# EAGLE design rgb_v3 (EAGLE 6.5.0)
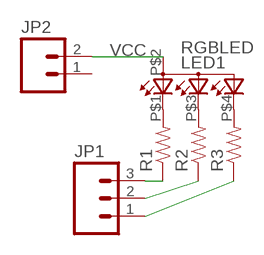
[diagram p0: schematic, sheet 1]

## Parts
JP1  M03NONPOLAR  [1X03NONPOLAR]
JP2  M02PTH  [1X02]
LED1  RGBLED  [CLVBA-FKA-CAEDH8BBB7A363]
R1  RESISTOR0402-RES  [0402-RES]
R2  RESISTOR0402-RES  [0402-RES]
R3  RESISTOR0402-RES  [0402-RES]

## Nets
N$1: LED1.P$1(CRED) R1.2
N$2: LED1.P$3(CBLUE) R2.2
N$3: LED1.P$4(CGREEN) R3.2
N$4: JP1.2 R2.1
N$5: JP1.1 R3.1
N$6: JP1.3 R1.1
VCC: JP2.2 LED1.P$2(A)
Unconnected: JP2.1

## Library data of the parts
JP1 = SparkFun-Connectors:M03: Header 3 Standard 3-pin 0.1" header. Use with straight break away headers (SKU : PRT-00116), right angle break away headers (PRT-00553), swiss pins (PRT-00743), machine pins (PRT-00117), and female headers (PRT-00115). Molex polarized connector foot print use with SKU : PRT-08232 with associated crimp pins and housings.
JP2 = SparkFun-Connectors:M02: Header 2 Standard 2-pin 0.1" header. Use with straight break away headers (SKU : PRT-00116), right angle break away headers (PRT-00553), swiss pins (PRT-00743), machine pins (PRT-00117), and female headers (PRT-00115). Molex polarized connector foot print use with SKU : PRT-08233 with associated crimp pins and housings.
LED1 = my library:RGBLED: Chip LED RGB Source: http://document.sharpsma.com/files/GM1WA55311A_SS.pdf
R1-R3 = SparkFun-Resistors:RESISTOR: Resistor Basic schematic elements and footprints for 0603, 1206, and PTH resistors.

## Board
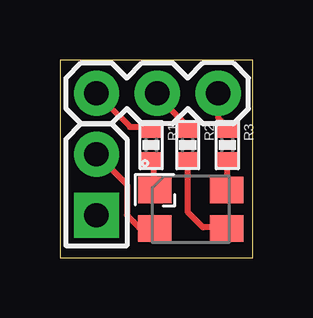
[diagram p1: board, top side]
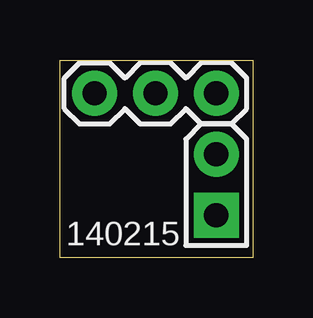
[diagram p2: board, bottom side, seen from below]

Size 8.05 x 8.24 mm. Coordinates in mm from the lower left corner, seen from the top.
Outline: 0,0 8.05,0 8.05,8.24 0,8.24 0,0
Copper layers (1*16): Top 0.0356mm / dielectric 1.5011mm / Bottom 0.0356mm
Design rules "LaenPCBOrder *": minimum track width 10mil, minimum drill 13mil, track to track 6mil, track to pad 6mil, pad to pad 6mil, via to via 6mil, smd to smd 6mil, copper to edge 15mil, drill to drill 6mil, minimum pad ring 7mil, minimum via ring 7mil, stop-mask expansion 3mil, vias tented up to drill 0mil, thermal gap 10mil

### Footprints (pad centres in the part's own frame; a part is rotated, then mirrored left to right if it is on the bottom)
1X03NONPOLAR = drill 1.016 pad 1.88: 1 0,0; 2 2.54,0; 3 5.08,0
1X02 = drill 1.016 pad 1.88 square: 1 0,0 | drill 1.016 pad 1.88: 2 2.54,0
CLVBA-FKA-CAEDH8BBB7A363 = smd 1.4 x 1.1: P$1 -1.5,0.8; P$2 -1.5,-0.8; P$3 1.5,-0.8; P$4 1.5,0.8
0402-RES = smd 0.7 x 0.9: 1 -0.65,0; 2 0.65,0

### Placement (x,y rotation side)
JP1  6.6,6.86 180 top
JP2  1.52,1.78 90 top
LED1  5.46,2.03 0 top
R1  3.81,4.7 270 top
R2  5.33,4.7 270 top
R3  6.99,4.7 270 top

### Tracks (layer width: path | path; a pad name or v marks a point on that pad's centre or on a via)
N$1
  Top 0.254: R1.2 3.81,3.94 3.94,3.81 3.94,2.92 LED1.P$1
N$2
  Top 0.254: R2.2 5.33,1.91 5.97,1.27 6.86,1.27 LED1.P$3
N$3
  Top 0.254: R3.2 6.99,2.92 LED1.P$4
N$4
  Top 0.254: JP1.2 4.06,6.73 5.33,5.46 R2.1
N$5
  Top 0.254: JP1.1 6.6,5.84 6.99,5.46 R3.1
N$6
  Top 0.254: JP1.3 2.16,6.22 2.92,5.46 3.81,5.46 R1.1
VCC
  Top 0.254: JP2.2 2.79,3.05 2.79,1.78 3.3,1.27 3.94,1.27 LED1.P$2

### Text on the board
bPlace: 140215